# EasyEDA Pro project PCB.epro

# Schematic Schematic1
Board Name: Board1; Create Date: 2025-04-18; Page Name: P1; Project Name: zhinengnongyebs; Schematic Name: Schematic1; Update Date: 2025-04-18; Company: 嘉立创EDA; Page Size: A4; Version: V1.0
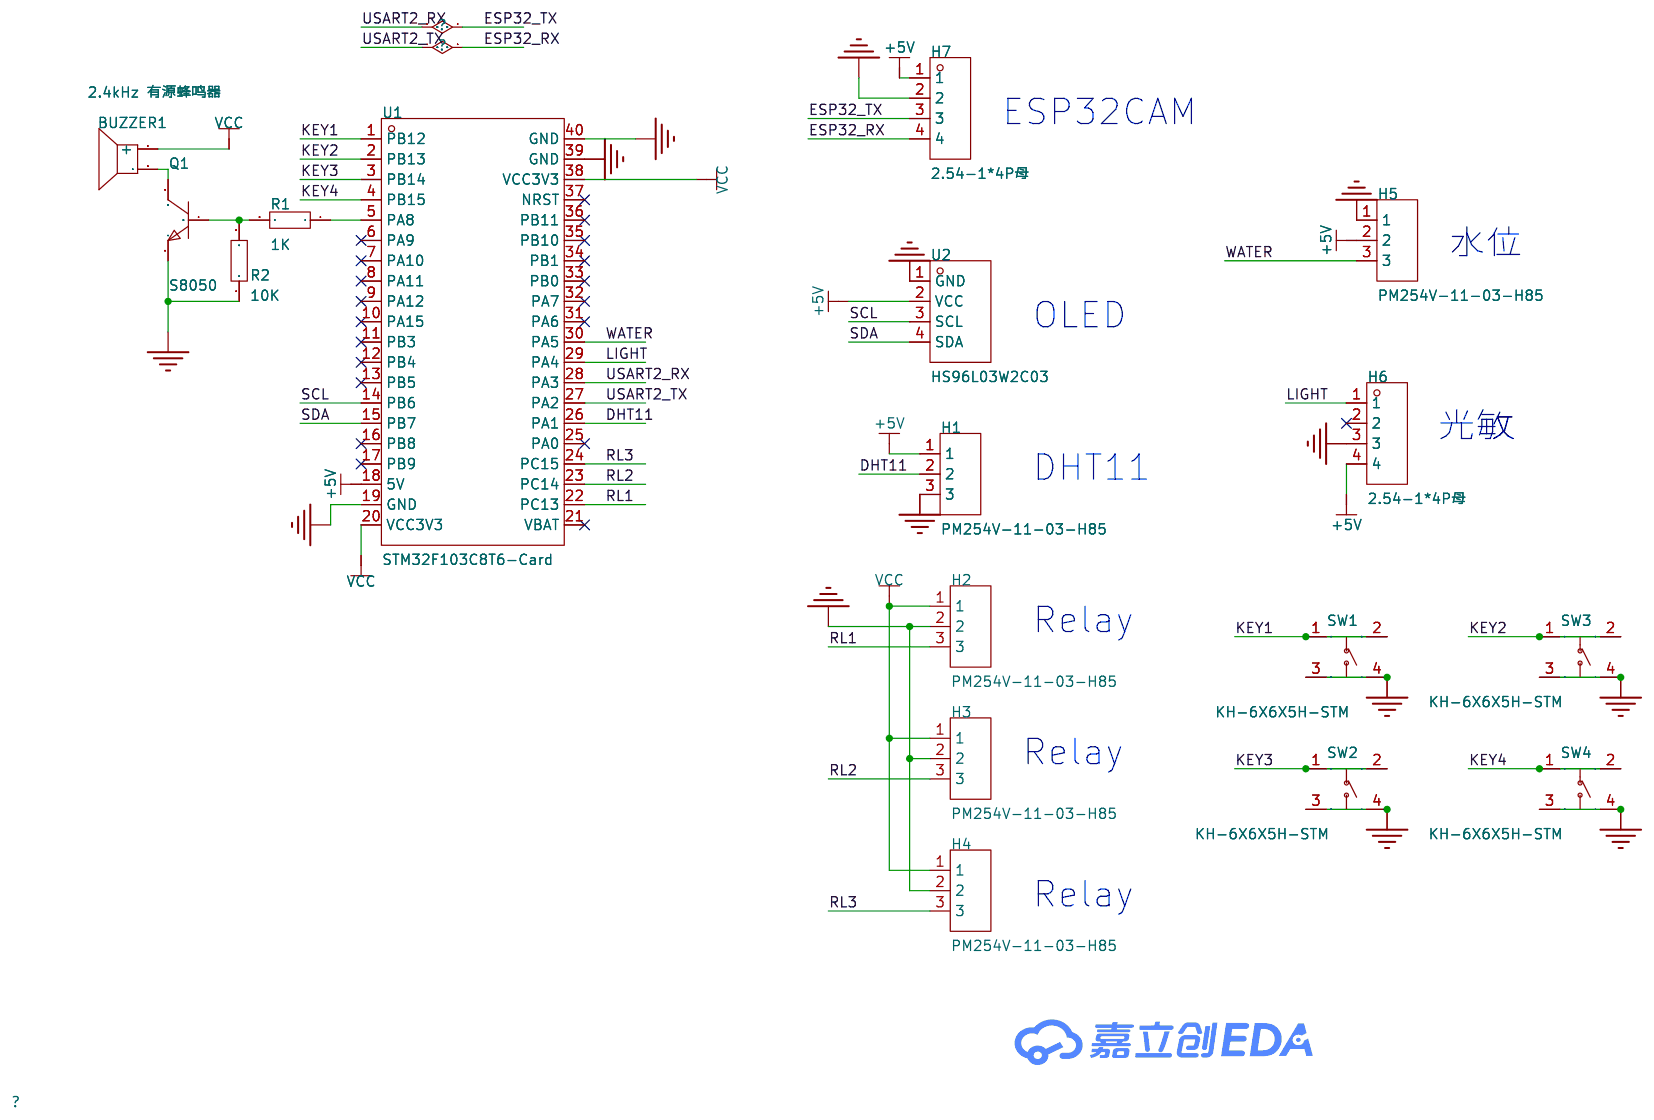
[diagram p0: schematic sheet]

## Parts
BUZZER1  2.4kHz 有源蜂鸣器  [BUZ-TH_BD12.0-P7.60-D0.6-FD]
H1  PM254V-11-03-H85  [HDR-TH_3P-P2.54-V-F]
H2  PM254V-11-03-H85  [HDR-TH_3P-P2.54-V-F]
H3  PM254V-11-03-H85  [HDR-TH_3P-P2.54-V-F]
H4  PM254V-11-03-H85  [HDR-TH_3P-P2.54-V-F]
H5  PM254V-11-03-H85  [HDR-TH_3P-P2.54-V-F]
H6  2.54-1*4P母  [HDR-TH_4P-P2.54-V-F]
H7  2.54-1*4P母  [HDR-TH_4P-P2.54-V-F]
Q1  S8050  [SOT-23-3_L2.9-W1.3-P1.90-LS2.3-BR]
R1  1K  [R0603]
R2  10K  [R0603]
SW1  KH-6X6X5H-STM  [SW-SMD_4P-L6.0-W6.0-P4.50-LS9.0-2]
SW2  KH-6X6X5H-STM  [SW-SMD_4P-L6.0-W6.0-P4.50-LS9.0-2]
SW3  KH-6X6X5H-STM  [SW-SMD_4P-L6.0-W6.0-P4.50-LS9.0-2]
SW4  KH-6X6X5H-STM  [SW-SMD_4P-L6.0-W6.0-P4.50-LS9.0-2]
U1  STM32F103C8T6-Card  [CONN-TH_L53.3-W22.9_STM32F103C8T6-CARD]
U2  HS96L03W2C03  [OLED-TH_L27.8-W27.2-P2.54_C9900033791]

## Library data of the parts
BUZZER1 = TMB12A05_C96093: 驱动方式:有源(内含驱动线路);构造类型:电磁式;额定电压:-;频率:2.4kHz;声压(SPL):85dB;; LCSC Part Name: TMB12A05; Supplier Part: C96093; Manufacturer: 华能; Manufacturer Part: TMB12A05; Supplier Footprint: 插件,D=12mm; JLCPCB Part Class: 扩展库; Datasheet: https://atta.szlcsc.com/upload/public/pdf/source/20241025/8A17FE04D767D19A35A06DEF9A82AB1E.pdf; Supplier: LCSC; Driver Circuitry: 有源(内含驱动线路); Technology: 电磁式; Voltage - Supply: 4V~8V; Sound Pressure Level(SPL): 85dB; Diameter(φD): 12mm; Height: 9.8mm
H1-H5 = PM254V-11-03-H85: 插孔结构:1x3P;间距:2.54mm;行距:-;安装类型:直插;排数:单排;总孔位数:3P;塑高:-;触头材质:黄铜;触头镀层:-;; LCSC Part Name: 间距:2.54mm 1x3P 直插; Supplier Part: C541850; Manufacturer: XFCN(兴飞); Supplier Footprint: 插件,P=2.54mm; JLCPCB Part Class: 扩展库; Datasheet: https://atta.szlcsc.com/upload/public/pdf/source/20200518/C541849_85853D71FC67C51915A806977A588FDA.pdf; Supplier: LCSC; Holes Structure: 1x3P; Pitch: 2.54mm; Mounting Type: 直插; Number of Rows: 单排; Number of Holes: 3P; Contact Material: 黄铜
H6 H7 = 2.54-1*4P母: 插孔结构:1x4P;间距:2.54mm;行距:-;圆孔/方孔:方孔;安装类型:直插;排数:单排;总孔位数:4P;额定电流:3A;额定电压:-;插孔方向:顶部;塑高:-;触头材质:青铜;触头镀层:-;工作温度范围:-40℃~+105℃;焊接温度(最大值):-;; LCSC Part Name: 间距:2.54mm 1x4P 直插; Supplier Part: C2718488; Manufacturer: BOOMELE(博穆精密); Supplier Footprint: 插件,P=2.54mm; JLCPCB Part Class: 扩展库; Datasheet: https://atta.szlcsc.com/upload/public/pdf/source/20210301/C2718488_F4427B881E42CAA8DDB0B1C12B3A522C.pdf; Supplier: LCSC; Holes Structure: 1x4P; Pitch: 2.54mm; Circular Hole / Square Hole: 方孔; Mounting Type: 直插; Number of Rows: 单排; Number of Holes: 4P; Current Rating (Max): 3A; Holes Direction: 顶部; Contact Material: 青铜; Operating Temperature Range: -40℃~+105℃
Q1 = S8050_C20069125: 晶体管类型:NPN;集电极电流(Ic):500mA;集射极击穿电压(Vceo):25V;耗散功率(Pd):300mW;直流电流增益(hFE):120@50mA,1.0V;; LCSC Part Name: hFE:200-350，丝印:J3Y S8050; Supplier Part: C20069125; Manufacturer: 宏嘉诚; Supplier Footprint: SOT-23; JLCPCB Part Class: 扩展库; Datasheet: https://atta.szlcsc.com/upload/public/pdf/source/20250107/343E8B94B5C24D0D65D7D4B70E0B73F6.pdf; Supplier: LCSC; type: NPN; Current - Collector(Ic): 500mA; Collector - Emitter Voltage VCEO: 25V; Pd - Power Dissipation: 300mW; DC Current Gain: 120@50mA,1.0V; Transition frequency(fT): 100MHz; Current - Collector Cutoff: 100nA; Vce Saturation(VCE(sat)): 600mV; Operating Temperature: -55℃~+150℃
R1 R2 = Res_0603: Supplier Footprint: 0603
SW1-SW4 = KH-6X6X5H-STM: 电路结构:单刀单掷;按钮形状:圆形按钮;安装方式:立贴;开关长度:6mm;开关宽度:6mm;开关高度:5mm;带支架:不带;触点电流:50mA;额定电压(DC):12V;机械寿命:8万次;; LCSC Part Name: 6*6*5mm 立贴 轻触开关; Supplier Part: C2837531; Manufacturer: kinghelm(金航标); Supplier Footprint: SMD; JLCPCB Part Class: 扩展库; Datasheet: https://atta.szlcsc.com/upload/public/pdf/source/20210608/C2837531_45E87AB996CE723B09405FF2EA209C4C.pdf; Supplier: LCSC; Circuit: 单刀单掷; Actuator Style: 圆形按钮; Mounting Style: 立贴; Switch Length: 6mm; Switch Width: 6mm; Switch Height: 5mm; Strike Gundam: 不带; Contact Current: 50mA; Voltage Rating (DC): 12V; Actuator/Cap Color: 黑色; Pin Style: 鸥翼型; Mechanical Life: 8万次
U1 = STM32F103C8T6-Card: Supplier Part: C9900077949; Supplier Footprint: 插件; JLCPCB Part Class: Extended Part; Supplier: LCSC
U2 = HS96L03W2C03: 主控芯片:SSD1315;接口类型:I2C;尺寸(inch):0.96;像素分辨率:128x64;; LCSC Part Name: 0.96寸OLED显示屏窄白光IIC; Supplier Part: C5248080; Manufacturer: HS(汉昇); JLCPCB Part Class: 扩展库; Datasheet: https://atta.szlcsc.com/upload/public/pdf/source/20230627/763D01F79A90007632F098068C7C8AD9.pdf; Supplier: LCSC; Main Control Chip: SSD1315; Interface Type: I2C; Size: 0.96; Pixel Resolution: 128x64; Operating Temperature: -40℃~+70℃

## Nets
+5V: H1.1 H5.2 H6.4 H7.1 U1.18(5V) U2.2(VCC)
GND: H1.3 H2.2 H3.2 H4.2 H5.1 H6.3 H7.2 Q1.2(E) R2.1 SW1.3 SW1.4 SW2.3 SW2.4 SW3.3 SW3.4 SW4.3 SW4.4 U1.19(GND) U1.39(GND) U1.40(GND) U2.1(GND)
VCC: BUZZER1.1(+) H2.1 H3.1 H4.1 U1.20(VCC3V3) U1.38(VCC3V3)
DHT11: H1.2 U1.26(PA1)
ESP32_RX: H7.4 U1.27(PA2)
ESP32_TX: H7.3 U1.28(PA3)
KEY1: SW1.1 SW1.2 U1.1(PB12)
KEY2: SW3.1 SW3.2 U1.2(PB13)
KEY3: SW2.1 SW2.2 U1.3(PB14)
KEY4: SW4.1 SW4.2 U1.4(PB15)
LIGHT: H6.1 U1.29(PA4)
RL1: H2.3 U1.22(PC13)
RL2: H3.3 U1.23(PC14)
RL3: H4.3 U1.24(PC15)
SCL: U1.14(PB6) U2.3(SCL)
SDA: U1.15(PB7) U2.4(SDA)
WATER: H5.3 U1.30(PA5)
$1N1846: BUZZER1.2 Q1.3(C)
$1N1962: Q1.1(B) R1.2 R2.2
$1N2002: R1.1 U1.5(PA8)

Not connected (* = marked no-connect by the designer): H6 2*; U1 6(PA9)* 7(PA10)* 8(PA11)* 9(PA12)* 10(PA15)* 11(PB3)* 12(PB4)* 13(PB5)* 16(PB8)* 17(PB9)* 21(VBAT)* 25(PA0)* 31(PA6)* 32(PA7)* 33(PB0)* 34(PB1)* 35(PB10)* 36(PB11)* 37(NRST)*

## Notes on the sheet
- ESP32CAM
- 水位
- OLED
- 光敏
- DHT11
- Relay
- Relay
- Relay

# Board PCB1
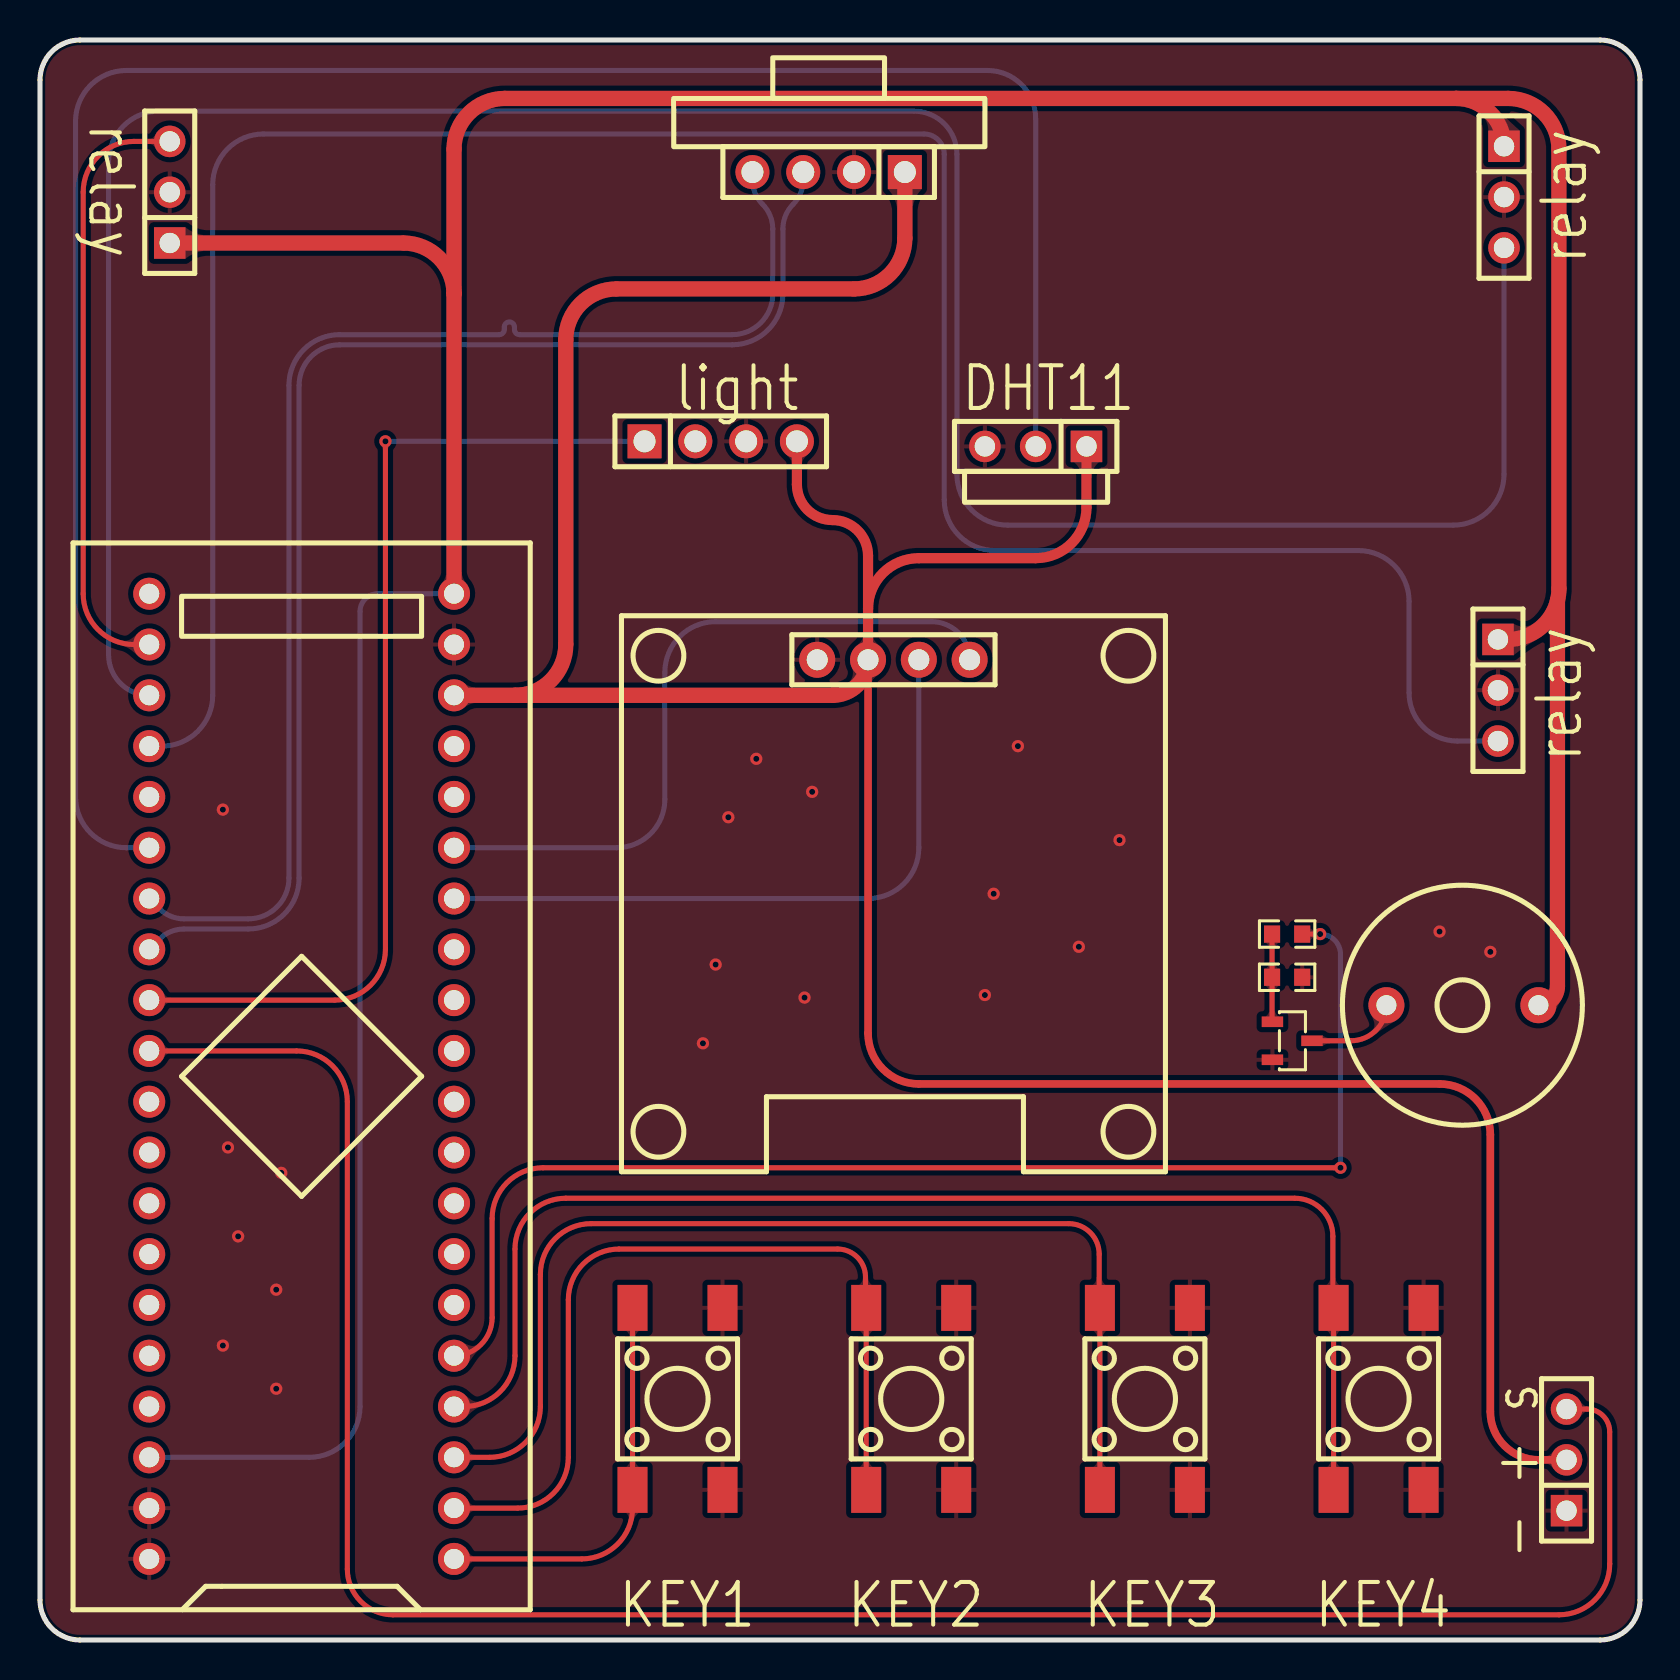
[diagram p1: board, top side]
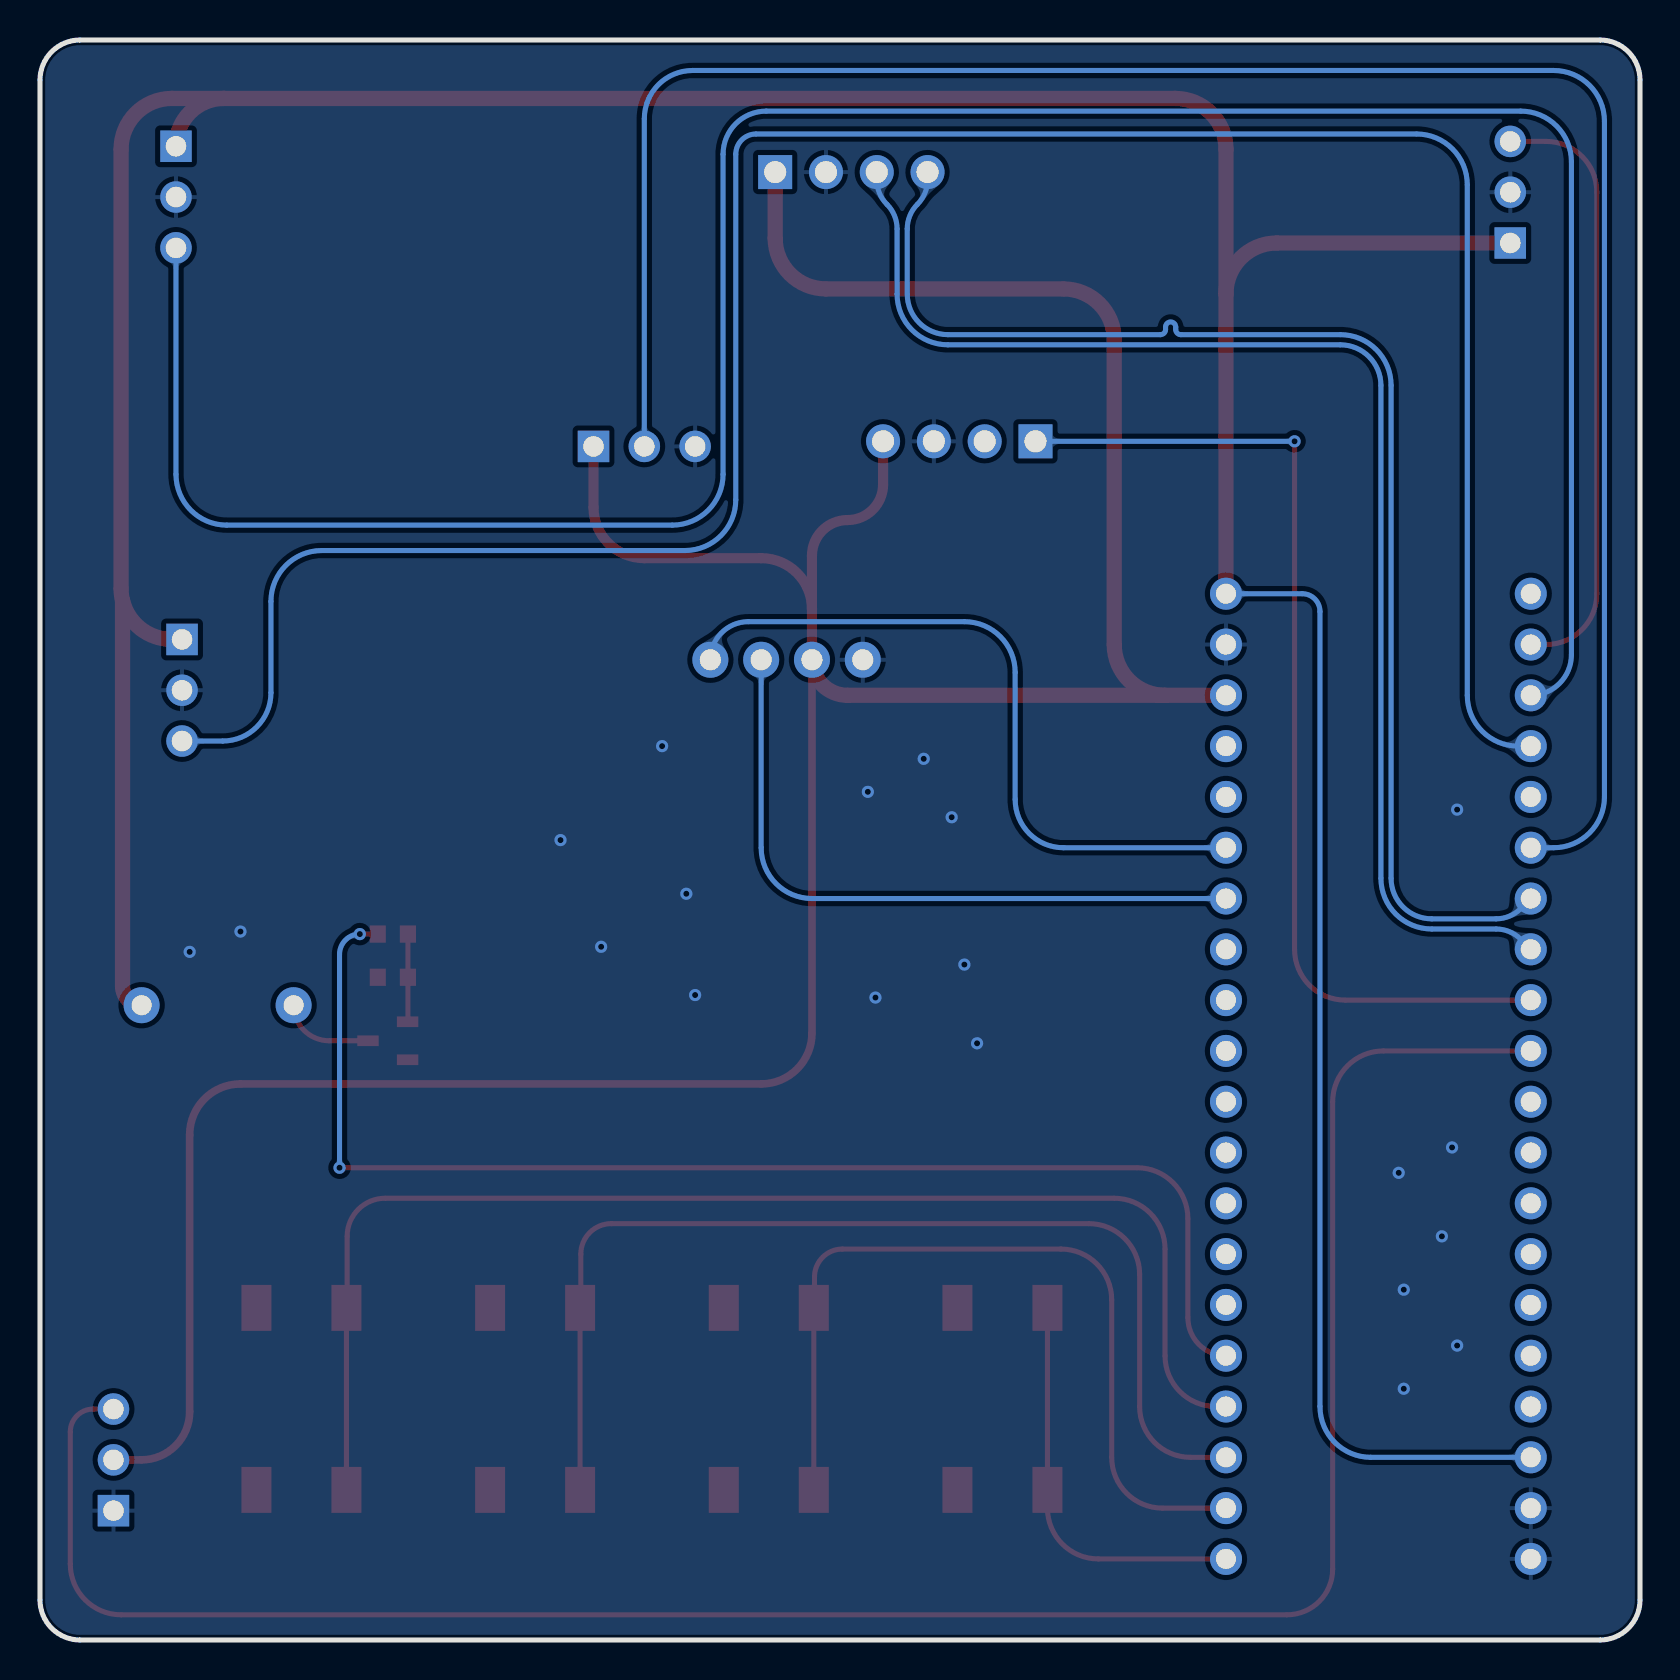
[diagram p2: board, bottom side, seen from below]

Outline 80 x 80 mm; copper layers: Top Layer, Bottom Layer. Coordinates in mm from the lower left corner of the outline.
Outline path: 0,78 0,2 arc(0.59,0.59) 2,0 78,0 arc(79.41,0.59) 80,2 80,78 arc(79.41,79.41) 78,80 2,80 arc(0.59,79.41) 0,78
Stack: Top Layer 0.035mm / Dielectric1 1.51mm FR4 er 4.5 / Bottom Layer 0.035mm

## Design rules (mm)
net ESP32_TX: DP1
net ESP32_RX: DP1
template: 自定义配置
spacing copperThickness1oz (default): track to track 0.102, other pairs 0.152 to 0.3
spacing copperThickness2oz: track to track 0.203, other pairs 0.152 to 0.3
track width copperThickness1oz (default): min 0.127, default 0.254, max 2.54
track width copperThickness2oz: min 0.203, default 0.254, max 2.54
differential pair differentialPair (default): width min 0.127, default 0.254, max 2.54; gap min 0.254, default 0.254
via viaSize (default): diameter min 0.5, default 0.61, max 10; hole min 0.3, default 0.305, max 6.299

## Placement (name value [footprint] x y rotation side)
BUZZER1  2.4kHz 有源蜂鸣器  [BUZ-TH_BD12.0-P7.60-D0.6-FD]  71.12 31.74 180 top
H1  PM254V-11-03-H85  [HDR-TH_3P-P2.54-V-F]  49.78 59.68 180 top
H2  PM254V-11-03-H85  [HDR-TH_3P-P2.54-V-F]  6.49 72.39 90 top
H3  PM254V-11-03-H85  [HDR-TH_3P-P2.54-V-F]  73.2 72.15 270 top
H4  PM254V-11-03-H85  [HDR-TH_3P-P2.54-V-F]  72.9 47.49 270 top
H5  PM254V-11-03-H85  [HDR-TH_3P-P2.54-V-F]  76.33 9.01 90 top
H6  2.54-1*4P母  [HDR-TH_4P-P2.54-V-F]  34.04 59.93 0 top
H7  2.54-1*4P母  [HDR-TH_4P-P2.54-V-F]  39.43 73.4 180 top
Q1  S8050  [SOT-23-3_L2.9-W1.3-P1.90-LS2.3-BR]  62.61 29.96 180 top
R1  1K  [R0603]  62.36 35.3 180 top
R2  10K  [R0603]  62.36 33.14 180 top
SW1  KH-6X6X5H-STM  [SW-SMD_4P-L6.0-W6.0-P4.50-LS9.0-2]  31.88 12.06 90 top
SW2  KH-6X6X5H-STM  [SW-SMD_4P-L6.0-W6.0-P4.50-LS9.0-2]  55.25 12.06 90 top
SW3  KH-6X6X5H-STM  [SW-SMD_4P-L6.0-W6.0-P4.50-LS9.0-2]  43.56 12.06 90 top
SW4  KH-6X6X5H-STM  [SW-SMD_4P-L6.0-W6.0-P4.50-LS9.0-2]  66.93 12.06 90 top
U1  STM32F103C8T6-Card  [CONN-TH_L53.3-W22.9_STM32F103C8T6-CARD]  13.08 28.18 90 top
U2  HS96L03W2C03  [OLED-TH_L27.8-W27.2-P2.54_C9900033791]  42.67 49.01 0 top

## Footprints (pads in the part's own frame, mm; a bottom-side part is the same pattern mirrored in y, then rotated)
BUZ-TH_BD12.0-P7.60-D0.6-FD
  round 1.8 hole 1: 1(-3.8,0) 2(3.8,0)
CONN-TH_L53.3-W22.9_STM32F103C8T6-CARD
  round 1.6 hole 1: 1(-24.13,-7.62) 2(-21.59,-7.62) 3(-19.05,-7.62) 4(-16.51,-7.62) 5(-13.97,-7.62) 6(-11.43,-7.62) 7(-8.89,-7.62) 8(-6.35,-7.62) 9(-3.81,-7.62) 10(-1.27,-7.62) 11(1.27,-7.62) 12(3.81,-7.62) 13(6.35,-7.62) 14(8.89,-7.62) 15(11.43,-7.62) 16(13.97,-7.62) 17(16.51,-7.62) 18(19.05,-7.62) 19(21.59,-7.62) 20(24.13,-7.62) 21(24.13,7.62) 22(21.59,7.62) 23(19.05,7.62) 24(16.51,7.62) 25(13.97,7.62) 26(11.43,7.62) 27(8.89,7.62) 28(6.35,7.62) 29(3.81,7.62) 30(1.27,7.62) 31(-1.27,7.62) 32(-3.81,7.62) 33(-6.35,7.62) 34(-8.89,7.62) 35(-11.43,7.62) 36(-13.97,7.62) 37(-16.51,7.62) 38(-19.05,7.62) 39(-21.59,7.62) 40(-24.13,7.62)
HDR-TH_3P-P2.54-V-F
  rect 1.575x1.575 hole 1.02: 1(-2.54,0)
  round 1.575 hole 1.02: 2(0,0) 3(2.54,0)
HDR-TH_4P-P2.54-V-F
  rect 1.7x1.7 hole 1.1: 1(-3.81,0)
  round 1.7 hole 1.1: 2(-1.27,0) 3(1.27,0) 4(3.81,0)
OLED-TH_L27.8-W27.2-P2.54_C9900033791
  round 1.8 hole 1.05: 1(-3.81,0) 2(-1.27,0) 3(1.27,0) 4(3.81,0)
R0603
  rect 0.806x0.864 smd: 1(-0.753,0) 2(0.753,0)
SOT-23-3_L2.9-W1.3-P1.90-LS2.3-BR
  rect 1.07x0.532 smd: 1(0.99,-0.95) 2(0.99,0.95) 3(-0.99,0)
SW-SMD_4P-L6.0-W6.0-P4.50-LS9.0-2
  rect 2.3x1.5 smd: 1(-4.55,2.25) 2(4.55,2.25) 3(-4.55,-2.25) 4(4.55,-2.25)

## Nets
As in the schematic.

Pads without a net: H6 2; U1 6 7 8 9 10 11 12 13 16 17 21 25 31 32 33 34 35 36 37

## Via types
v1: diameter 0.61, hole 0.305, Top Layer to Bottom Layer, 23 vias

## Routing (per net, layer and track width the routed paths; a pad name or vN(x,y) marks a point on that pad's centre or on a via; arc(x,y) is an arc through that point)
+5V: length 165.6
  Top Layer w0.381: H5.2 74.93,9.01 arc(73.22,9.71) 72.52,11.42 72.52,25.26 arc(71.77,27.06) 69.98,27.8 43.94,27.8 arc(42.15,28.55) 41.4,30.34 U2.2
  Top Layer w0.508: 41.4,51.55 41.4,54.22 arc(40.88,55.48) 39.62,56 arc(38.37,56.52) 37.85,57.78 H6.4 ; 41.4,51.55 U2.2 ; 41.4,51.55 arc(42.15,53.35) 43.94,54.09 49.78,54.09 arc(51.58,54.84) 52.32,56.63 H1.1
  Top Layer w0.762: H7.1 43.24,70.09 arc(42.5,68.3) 40.7,67.55 28.83,67.55 arc(27.03,66.81) 26.29,65.01 26.29,49.77 arc(25.55,47.98) 23.75,47.23 ; U1.18 23.75,47.23 ; 23.75,47.23 39.62,47.23 arc(40.88,47.75) U2.2
GND:
  vias: v1(9.14,41.52) v1(9.14,14.72) v1(9.4,24.63) v1(9.91,20.18) v1(11.81,17.52) v1(11.81,12.56) v1(12.06,23.36) v1(33.15,29.83) v1(33.78,33.77) v1(34.42,41.14) v1(35.81,44.06) v1(38.23,32.12) v1(38.61,42.41) v1(47.24,32.25) v1(47.68,37.31) v1(48.9,44.69) v1(51.94,34.66) v1(53.97,40) v1(69.98,35.42) v1(72.52,34.41)
VCC: length 204
  Top Layer w0.762: H2.1 18.16,69.85 arc(19.96,69.11) 20.7,67.31 ; H4.1 73.41,50.03 arc(74.97,50.57) 75.87,51.96 ; 70.81,77.08 73.41,77.08 arc(75.2,76.34) 75.95,74.54 75.95,52.57 arc(75.93,52.26) 75.87,51.96 ; 70.81,77.08 23.24,77.08 arc(21.44,76.34) 20.7,74.54 20.7,67.31 ; 70.81,77.08 arc(72.5,76.38) H3.1 ; 75.87,51.96 75.87,32.69 arc(75.59,32.02) BUZZER1.1 ; 20.7,67.31 U1.20
  Bottom Layer w0.254: U1.38 13.46,9.13 arc(15.26,9.88) 16,11.67 16,51.42 arc(16.26,52.05) 16.89,52.31 U1.20
DHT11: length 106.1
  Bottom Layer w0.254: H1.2 49.78,76.06 arc(49.08,77.77) 47.37,78.48 4.32,78.48 arc(2.52,77.73) 1.78,75.94 1.78,42.15 arc(2.52,40.36) 4.32,39.61 U1.26
ESP32_RX: length 67.1
  Bottom Layer w0.254: H7.4 35.62,73.01 arc(35.75,72.35) 36.13,71.78 arc(36.51,71.22) 36.64,70.56 36.64,67.3 arc(36.04,65.86) 34.61,65.27 23.98,65.27 arc(23.8,65.34) 23.72,65.52 23.72,65.65 arc(23.47,65.9) 23.21,65.65 23.21,65.52 arc(23.14,65.34) 22.96,65.27 14.99,65.27 arc(13.19,64.52) 12.45,62.73 12.45,38.09 arc(11.85,36.65) 10.41,36.06 7.2,36.06 arc(6.53,36.19) 5.97,36.57 U1.27
ESP32_TX: length 67.1
  Bottom Layer w0.254: U1.28 5.97,35.04 arc(6.53,35.42) 7.2,35.55 10.41,35.55 arc(12.21,36.29) 12.95,38.09 12.95,62.73 arc(13.55,64.16) 14.99,64.76 34.61,64.76 arc(36.4,65.5) 37.15,67.3 37.15,70.56 arc(37.28,71.22) 37.65,71.78 arc(38.03,72.35) 38.16,73.01 H7.3
KEY1: length 20.4
  Top Layer w0.254: 29.63,16.6 SW1.1 29.63,6.59 arc(28.88,4.8) 27.09,4.05 U1.1
KEY2: length 42.8
  Top Layer w0.254: 41.31,7.51 41.31,16.6 arc(41.29,16.62) 41.28,16.64 41.28,18.15 arc(40.87,19.14) 39.88,19.55 28.96,19.55 arc(27.16,18.8) 26.42,17.01 26.42,9.13 arc(25.67,7.34) 23.88,6.59 U1.2
KEY3: length 54.4
  Top Layer w0.254: 53,7.51 53,16.6 arc(52.97,16.62) 52.96,16.64 52.96,19.29 arc(52.51,20.37) 51.44,20.82 27.56,20.82 arc(25.76,20.07) 25.02,18.28 25.02,11.67 arc(24.28,9.88) 22.48,9.13 U1.3
KEY4: length 66
  Top Layer w0.254: 64.68,7.51 64.68,16.6 arc(64.65,16.62) 64.64,16.64 64.64,20.18 arc(64.09,21.53) 62.74,22.09 26.29,22.09 arc(24.49,21.34) 23.75,19.55 23.75,14.21 arc(23.01,12.42) 21.21,11.67 U1.4
LIGHT: length 51.6
  Top Layer w0.254: U1.29 14.73,31.99 arc(16.53,32.74) 17.27,34.53 v1(17.27,59.93)
  Bottom Layer w0.254: v1(17.27,59.93) H6.1
RL1: length 30.6
  Top Layer w0.254: U1.22 4.7,49.77 arc(2.9,50.52) 2.16,52.31 2.16,72.39 arc(2.9,74.19) 4.7,74.93 H2.3
RL2: length 130.5
  Bottom Layer w0.254: H3.3 73.2,58.28 arc(72.46,56.49) 70.66,55.74 48.39,55.74 arc(46.59,56.49) 45.85,58.28 45.85,74.28 arc(45.21,75.81) 43.69,76.44 5.97,76.44 arc(4.17,75.7) 3.43,73.9 3.43,49.27 arc(4.02,47.83) U1.23
RL3: length 122.6
  Bottom Layer w0.254: U1.24 6.1,44.69 arc(7.89,45.44) 8.64,47.23 8.64,72.76 arc(9.38,74.56) 11.18,75.3 44.2,75.3 arc(44.91,75) 45.21,74.28 45.21,57.01 arc(45.96,55.22) 47.75,54.47 65.91,54.47 arc(67.71,53.73) 68.45,51.93 68.45,47.36 arc(69.16,45.65) 70.87,44.95 H4.3
SCL: length 34.1
  Bottom Layer w0.254: U1.14 41.4,37.07 arc(43.2,37.82) 43.94,39.61 U2.3
SDA: length 36
  Bottom Layer w0.254: U1.15 28.83,39.61 arc(30.54,40.32) 31.24,42.03 31.24,48.38 arc(31.99,50.17) 33.78,50.92 44.58,50.92 arc(45.92,50.36) U2.4
WATER: length 110
  Top Layer w0.254: H5.3 77.34,11.55 arc(78.15,11.21) 78.49,10.4 78.49,3.8 arc(77.74,2) 75.95,1.26 17.65,1.26 arc(16.04,1.93) 15.37,3.55 15.37,26.91 arc(14.62,28.71) 12.83,29.45 U1.30
$1N1846: length 4.7
  Top Layer w0.254: Q1.3 65.54,29.96 arc(66.8,30.48) BUZZER1.2
$1N1962: length 4.4
  Top Layer w0.254: R1.2 R2.2 61.6,30.93 arc(61.61,30.92) Q1.1
$1N2002: length 65
  Top Layer w0.254: v1(65.02,23.61) 25.15,23.61 arc(23.35,22.87) 22.61,21.07 22.61,16.12 arc(22.05,14.77) U1.5 ; v1(64.01,35.3) R1.1
  Bottom Layer w0.254: v1(65.02,23.61) 65.02,34.28 arc(64.73,35) v1(64.01,35.3)

## Copper pours and planes (outline as drawn; the poured copper is in the pictures)
GND on Top Layer: -4.44,85.21 94.62,85.21 94.62,-7.5 -4.44,-7.5
GND on Bottom Layer: -5.33,86.48 84.71,86.48 84.71,-5.09 -5.33,-5.09

Small or netless copper shapes (teardrops, artwork), in the pictures only: 45 on Top Layer, 20 on Bottom Layer

## Text on the board
Top Silkscreen Layer: KEY1 | KEY2 | KEY3 | KEY4 | - + s | relay | light | DHT11
